# EAGLE design APRS-ESP32_SA8x8_Rev_A (EAGLE 9.6.2)
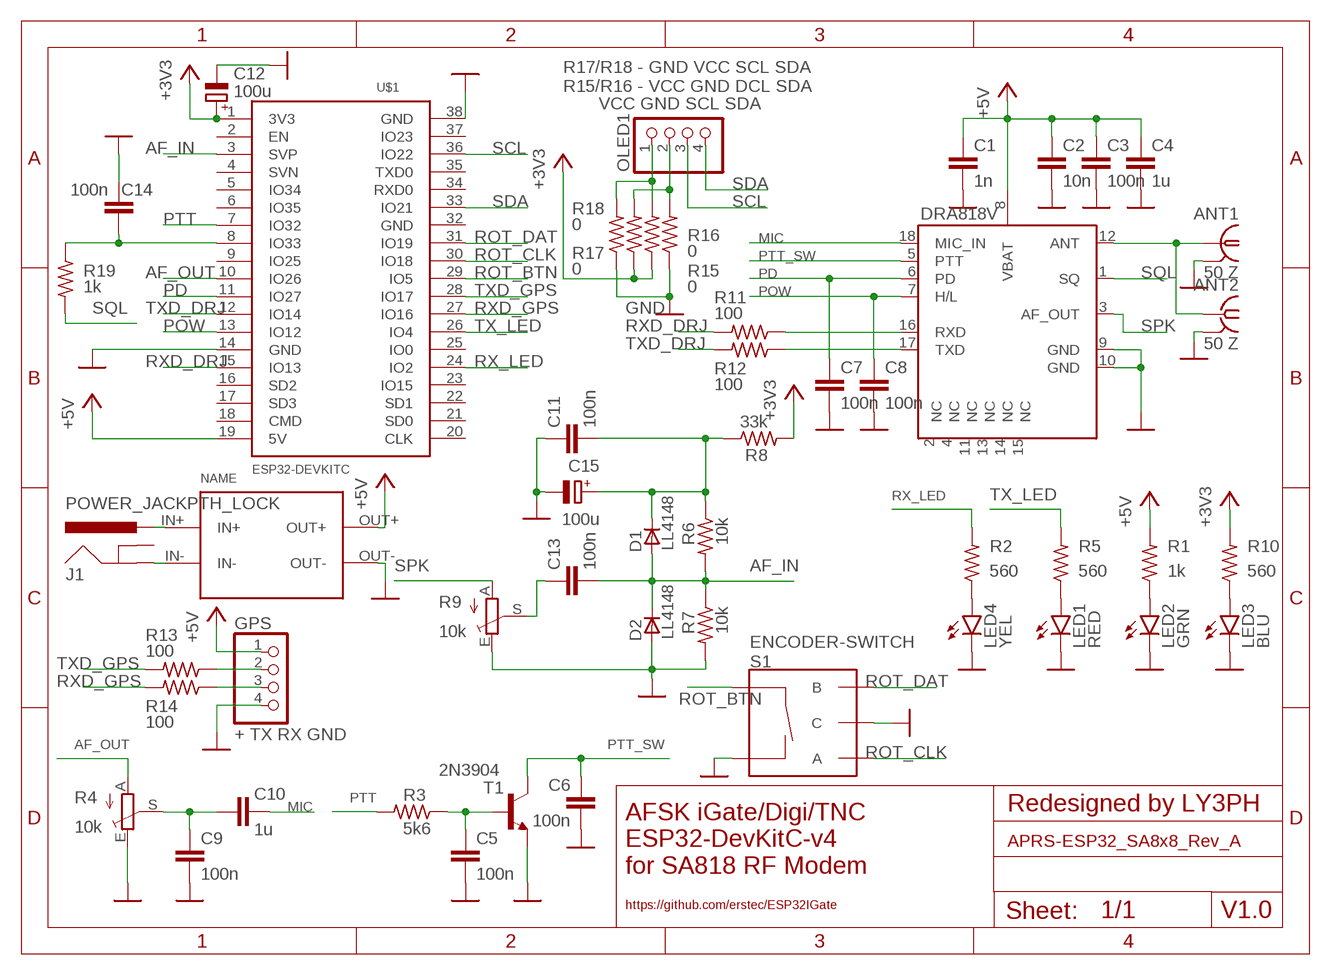
[diagram p0: schematic, sheet 1]

## Parts
ANT1  50 Z  LTI-SASF54GT  [LTI-SASF54GT]
ANT2  50 Z  SMA-142-0701-801/806  [J502-ND-142-0701-801/806]
C1  1n  C-EUC0805  [C0805]
C2  10n  C-EUC0805  [C0805]
C3  100n  C-EUC0805  [C0805]
C4  1u  C-EUC0805  [C0805]
C5  100n  C-EUC0805  [C0805]
C6  100n  C-EUC0805  [C0805]
C7  100n  C-EUC0805  [C0805]
C8  100n  C-EUC0805  [C0805]
C9  100n  C-EUC0805  [C0805]
C10  1u  C-EUC0805  [C0805]
C11  100n  C-EUC0805  [C0805]
C12  100u  CPOL-EUSMCD  [SMC_D]
C13  100n  C-EUC0805  [C0805]
C14  100n  C-EUC0805  [C0805]
C15  100u  CPOL-EUSMCD  [SMC_D]
D1  LL4148  [SOD80_DO213AA_MINIMELF]
D2  LL4148  [SOD80_DO213AA_MINIMELF]
DRA818V  DRA818A  [DRA818A]
GPS  + TX RX GND  PINHD-1X4  [1X04]
J1  POWER_JACKPTH_LOCK  [POWER_JACK_PTH_LOCK]
LED1  RED  LEDCHIP-LED0805  [CHIP-LED0805]
LED2  GRN  LEDCHIP-LED0805  [CHIP-LED0805]
LED3  BLU  LEDCHIP-LED0805  [CHIP-LED0805]
LED4  YEL  LEDCHIP-LED0805  [CHIP-LED0805]
OLED1  VCC GND SCL SDA  PINHD-1X4  [1X04]
R1  1k  R-US_R0805  [R0805]
R2  560  R-US_R0805  [R0805]
R3  5k6  R-US_R0805  [R0805]
R4  10k  TRIM_EU-CA6H  [CA6H]
R5  560  R-US_R0805  [R0805]
R6  10k  R-US_R0805  [R0805]
R7  10k  R-US_R0805  [R0805]
R8  33k  R-US_R0805  [R0805]
R9  10k  TRIM_EU-CA6H  [CA6H]
R10  560  R-US_R0805  [R0805]
R11  100  R-US_R0805  [R0805]
R12  100  R-US_R0805  [R0805]
R13  100  R-US_R0805  [R0805]
R14  100  R-US_R0805  [R0805]
R15  0  R-US_R0805  [R0805]
R16  0  R-US_R0805  [R0805]
R17  0  R-US_R0805  [R0805]
R18  0  R-US_R0805  [R0805]
R19  1k  R-US_R0805  [R0805]
S1  ENCODER-SWITCH  [ROTARY_ENC_PLAIN]
T1  2N3904  MMBT3904LT1-NPN-SOT23-BEC  [SOT23-BEC]
U$1  ESP32DEVKITC  [ESP32-DEVKITC]
U$2  CP8-ADJ  [CP8-ADJ]

## Nets
+3V3: C12.+ R8.2 R10.2 R15.1 R17.1 U$1.1(3V3)
+5V: C1.1 C2.1 C3.1 C4.1 DRA818V.8(VBAT) GPS.1 R1.2 U$1.19(5V) U$2.OUT+
AF_IN: C13.2 D1.A D2.C R6.2 R7.1 U$1.3(SVP)
AF_OUT: R4.A U$1.10(IO26)
GND: ANT1.2 ANT1.3 ANT1.4 ANT1.5 ANT2.G@1 ANT2.G@2 ANT2.G@3 ANT2.G@4 C1.2 C2.2 C3.2 C4.2 C5.2 C6.2 C7.2 C8.2 C9.2 C11.1 C12.- C14.2 C15.- D2.A DRA818V.9(GND) DRA818V.10(GND) GPS.4 LED1.C LED2.C LED3.C LED4.C R4.E R7.2 R9.E R16.1 R18.1 S1.C S1.SW- T1.E U$1.14(GND) U$1.38(GND) U$2.OUT-
MIC: C10.2 DRA818V.18(MIC_IN)
N$1: LED1.A R5.1
N$2: C11.2 C15.+ D1.C R6.1 R8.1
N$3: GPS.2 R13.1
N$4: C13.1 R9.S
N$5: ANT1.1 ANT2.1 DRA818V.12(ANT)
N$6: J1.PWR U$2.IN+
N$7: C5.1 R3.1 T1.B
N$8: LED4.A R2.1
N$9: C9.1 C10.1 R4.S
N$10: J1.GND U$2.IN-
N$12: LED3.A R10.1
N$13: GPS.3 R14.1
N$14: DRA818V.16(RXD) R11.1
N$15: DRA818V.17(TXD) R12.1
N$16: OLED1.2 R16.2 R17.2
N$17: OLED1.1 R15.2 R18.2
N$18: C14.1 R19.1 U$1.8(IO33)
N$41: LED2.A R1.1
PD: C7.1 DRA818V.6(PD) U$1.11(IO27)
POW: C8.1 DRA818V.7(H/L) U$1.13(IO12)
PTT: R3.2 U$1.7(IO32)
PTT_SW: C6.1 DRA818V.5(PTT) T1.C
ROT_BTN: S1.SW+ U$1.29(IO5)
ROT_CLK: S1.A U$1.30(IO18)
ROT_DAT: S1.B U$1.31(IO19)
RX_LED: R2.2 U$1.24(IO2)
RXD_DRJ: R11.2 U$1.15(IO13)
RXD_GPS: R14.2 U$1.27(IO16)
SCL: OLED1.3 U$1.36(IO22)
SDA: OLED1.4 U$1.33(IO21)
SPK: DRA818V.3(AF_OUT) R9.A
SQL: DRA818V.1(SQ) R19.2
TX_LED: R5.2 U$1.26(IO4)
TXD_DRJ: R12.2 U$1.12(IO14)
TXD_GPS: R13.2 U$1.28(IO17)
Unconnected: DRA818V.2(NC) DRA818V.4(NC) DRA818V.11(NC) DRA818V.13(NC) DRA818V.14(NC) DRA818V.15(NC) J1.GNDBREAK U$1.2(EN) U$1.4(SVN) U$1.5(IO34) U$1.6(IO35) U$1.9(IO25) U$1.16(SD2) U$1.17(SD3) U$1.18(CMD) U$1.20(CLK) U$1.21(SD0) U$1.22(SD1) U$1.23(IO15) U$1.25(IO0) U$1.32(GND) U$1.34(RXD0) U$1.35(TXD0) U$1.37(IO23)

## Notes on the sheet
- R17/R18 - GND VCC SCL SDA
  R15/R16 - VCC GND DCL SDA
- Redesigned by LY3PH
- AFSK iGate/Digi/TNC
  ESP32-DevKitC-v4
  for SA818 RF Modem
- https://github.com/erstec/ESP32IGate
- V1.0

## Library data of the parts
ANT1 = con-coax:LTI-SASF54GT: SMA vertical PCB thrue hole jack Source: Lighthorse Technologies, inc. SASF54GT.pdf; OC_FARNELL: unknown; OC_NEWARK: unknown
ANT2 = con-coax:SMA-: SMA 50 Ohm End Launch Jack Receptacle - Round Contact Johnson Components Source: www.johnsoncomponents.com .. J502-ND.pdf; MF: JOHNSON COMPONENTS; MPN: 142-0701-801; OC_FARNELL: 1608592; OC_NEWARK: 90F2624
C1-C11 C13 C14 = resistor:C-EU: CAPACITOR, European symbol
C12 C15 = rcl:CPOL-EU: POLARIZED CAPACITOR, European symbol; SPICEPREFIX: C
D1 D2 = _hhn_diodes_smd:LL4148: 1N4148 General Purpose Rectifie SMD-Version of 1N4148 Case: SOD 80 = DO 213 AA = MINIMELF (Glass) Author: Dipl.-Ing. FH Rainer Bayer HHN Hochschule Heilbronn, rainer.bayer@hs-heilbronn.de Ingenieurbüro ing-rb, mail@ing-rb.de
DRA818V = dorji:DRA818A
GPS OLED1 = pinhead:PINHD-1X4: PIN HEADER
J1 = SparkFun-Connectors:POWER_JACK: Power Jack Connector This is the standard 5.5mm barrel jack for power. The PTH is the most common, proven, reliable, footprint. The Slot footprint only works if the mill layer is transmitted to the PCB fab house so be warned. Here are the connectors we sell at SparkFun: DC Barrel Power Jack/Connector <https://www.sparkfun.com/products/119> (PRT-00119) DC Barrel Power Jack/Connector (SMD) <https://www.sparkfun.com/products/12748> (PRT-12748) DC Barrel Jack Adapter - Breadboard Compatible <https://www.sparkfun.com/products/10811> (PRT-10811) It is used on this SparkFun product (and many, many others): SparkFun RedBoard - Programmed with Arduino <https://www.sparkfun.com/products/12757> (DEV-12757) Also, if you need a mating power supply or connector, please check these out: Wall Adapter Power Supply - 9VDC 650mA <https://www.sparkfun.com/products/298> (TOL-00298) DC Barrel Jack Adapter - Male <https://www.sparkfun.com/products/10287> (PRT-10287); PROD_ID: CONN-08197; SF_ID: PRT-00119
LED1-LED4 = led:LED: LED OSRAM: - CHIPLED LG R971, LG N971, LY N971, LG Q971, LY Q971, LO R971, LY R971 LH N974, LH R974 LS Q976, LO Q976, LY Q976 LO Q996 - Hyper CHIPLED LW Q18S LB Q993, LB Q99A, LB R99A - SideLED LS A670, LO A670, LY A670, LG A670, LP A670 LB A673, LV A673, LT A673, LW A673 LH A674 LY A675 LS A676, LA A676, LO A676, LY A676, LW A676 LS A679, LY A679, LG A679 - Hyper Micro SIDELED® LS Y876, LA Y876, LO Y876, LY Y876 LT Y87S - SmartLED LW L88C, LW L88S LB L89C, LB L89S, LG L890 LS L89K, LO L89K, LY L89K LS L896, LA L896, LO L896, LY L896 - TOPLED LS T670, LO T670, LY T670, LG T670, LP T670 LSG T670, LSP T670, LSY T670, LOP T670, LYG T670 LG T671, LOG T671, LSG T671 LB T673, LV T673, LT T673, LW T673 LH T674 LS T676, LA T676, LO T676, LY T676, LB T676, LH T676, LSB T676, LW T676 LB T67C, LV T67C, LT T67C, LS T67K, LO T67K, LY T67K, LW E67C LS E67B, LA E67B, LO E67B, LY E67B, LB E67C, LV E67C, LT E67C LW T67C LS T679, LY T679, LG T679 LS T770, LO T770, LY T770, LG T770, LP T770 LB T773, LV T773, LT T773, LW T773 LH T774 LS E675, LA E675, LY E675, LS T675 LS T776, LA T776, LO T776, LY T776, LB T776 LHGB T686 LT T68C, LB T68C - Hyper Mini TOPLED® LB M676 - Mini TOPLED Santana® LG M470 LS M47K, LO M47K, LY M47K Source: http://www.osram.convergy.de LUXEON: - LUMILED® LXK2-PW12-R00, LXK2-PW12-S00, LXK2-PW14-U00, LXK2-PW14-V00 LXK2-PM12-R00, LXK2-PM12-S00, LXK2-PM14-U00 LXK2-PE12-Q00, LXK2-PE12-R00, LXK2-PE12-S00, LXK2-PE14-T00, LXK2-PE14-U00 LXK2-PB12-K00, LXK2-PB12-L00, LXK2-PB12-M00, LXK2-PB14-N00, LXK2-PB14-P00, LXK2-PB14-Q00 LXK2-PR12-L00, LXK2-PR12-M00, LXK2-PR14-Q00, LXK2-PR14-R00 LXK2-PD12-Q00, LXK2-PD12-R00, LXK2-PD12-S00 LXK2-PH12-R00, LXK2-PH12-S00 LXK2-PL12-P00, LXK2-PL12-Q00, LXK2-PL12-R00 Source: www.luxeon.com KINGBRIGHT: KA-3528ASYC Source: www.kingbright.com
R1-R3 R5-R8 R10-R19 = resistor:R-US_: RESISTOR, American symbol
R4 R9 = pot:TRIM_EU-: POTENTIOMETER
S1 = SparkFun-Switches:ENCODER-SWITCH: Rotary Encoder w/ Select Switch Encoders rotate similarly to potentiometers, but they’re different from potentiometers in that an encoder has full rotation without limits. They output gray code so that you can tell how much and in which direction the encoder has been turned. This encoder includes a push-down select switch built into the shaft. SparkFun Products Rotary Encoder <https://www.sparkfun.com/products/9117> (COM-09117); SF_SKU: COM-09117
T1 = transistor:*-NPN-: NPN Transistror BF959 corrected 2008.03.06
U$1 = ESP32-DEVKITC:ESP32DEVKITC
U$2 = userlib:CP8-ADJ: Voltage regulator IN: 7-35V OUT: ADJ

## Board
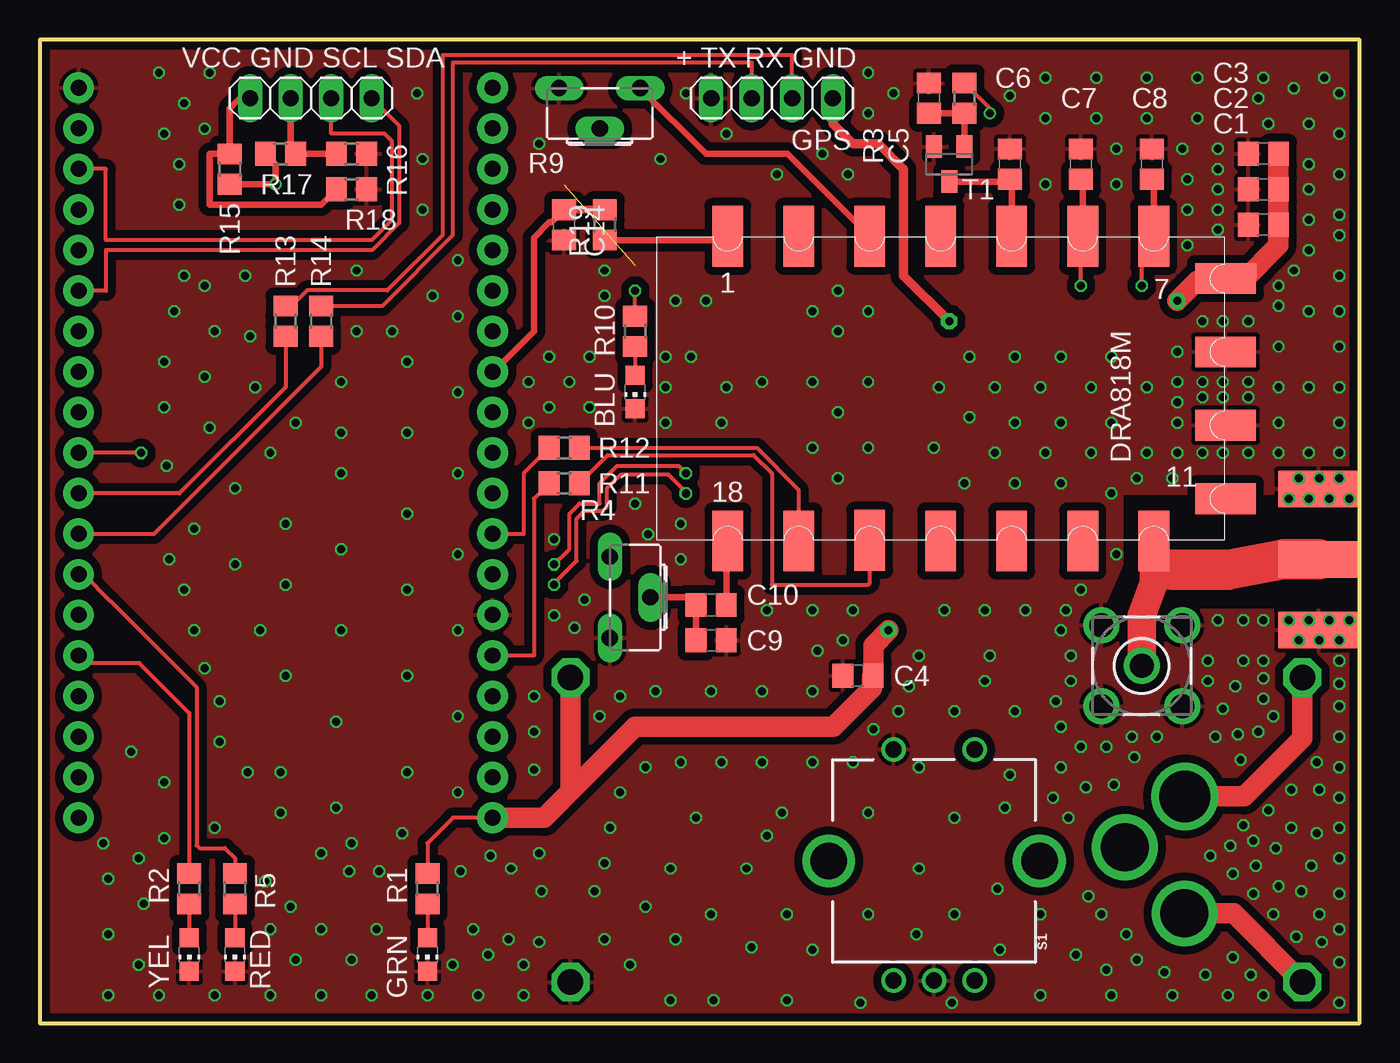
[diagram p1: board, top side]
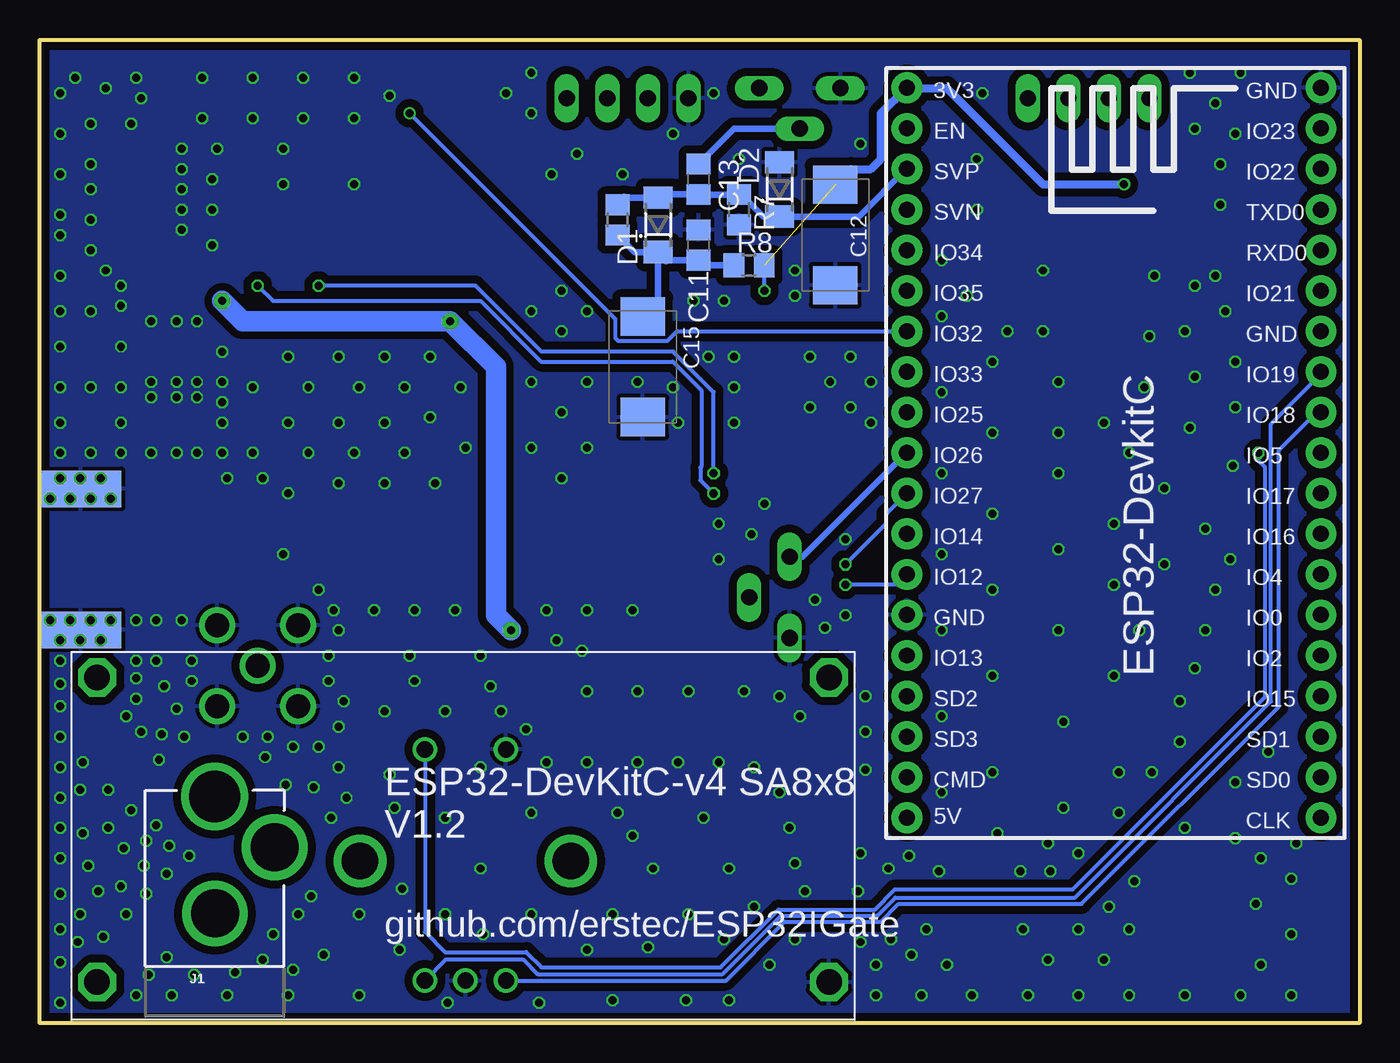
[diagram p2: board, bottom side, seen from below]

Size 82.71 x 61.59 mm. Coordinates in mm from the lower left corner, seen from the top.
Outline: 0,61.6 0,0 82.71,0 82.71,61.6 0,61.6
Copper layers (1*16): Top 0.035559375mm / dielectric 1.6mm / Bottom 0.035559375mm
Design rules "jlcpcb-2layers *": minimum track width 5mil, minimum drill 12mil, track to track 5mil, track to pad 5mil, pad to pad 5mil, via to via 5mil, smd to smd 5mil, copper to edge 8mil, drill to drill 6mil, minimum pad ring 5mil, minimum via ring 3mil, stop-mask expansion 2.5mil, vias tented up to drill 100mil, thermal gap 10mil

### Footprints (pad centres in the part's own frame; a part is rotated, then mirrored left to right if it is on the bottom)
LTI-SASF54GT = drill 1.5 pad 2.2: 1 0,0; 2 -2.54,2.54; 3 2.54,2.54; 4 2.54,-2.54; 5 -2.54,-2.54
J502-ND-142-0701-801/806 = smd 5.08 x 2.286: 1 2.565,0; G@1 2.565,4.42; G@2 2.565,-4.42 | smd 5.08 x 2.286 bottom: G@3 2.565,4.42; G@4 2.565,-4.42
C0805 = smd 1.3 x 1.5: 1 -0.95,0; 2 0.95,0
SMC_D = smd 2.4 x 2.8: + -3.15,0; - 3.15,0
SOD80_DO213AA_MINIMELF = smd 1.4 x 1.8: A 1.7,0; C -1.7,0
DRA818A = smd 3.81 x 1.93: 1 -9.45,-13.25; 2 -9.45,-8.8; 3 -9.45,-4.35; 4 -9.45,0.1; 5 -9.45,4.55; 6 -9.45,9; 7 -9.45,13.45; 12 9.65,13.45; 13 9.65,9; 14 9.65,4.55; 15 9.65,0.1; 16 9.6,-4.35; 17 9.65,-8.8; 18 9.65,-13.25 | smd 1.93 x 3.81: 8 -6.8,17.95; 9 -2.2,17.95; 10 2.4,17.95; 11 7,17.95
1X04 = drill 1.016 long: 1 -3.81,0; 2 -1.27,0; 3 1.27,0; 4 3.81,0
POWER_JACK_PTH_LOCK = drill 2.997 pad 4.115: GND 0.025,6.557; GNDBREAK 3.762,10.7 | drill 3.2 pad 4.115: PWR 0,13.878
CHIP-LED0805 = smd 1.2 x 1.2: A 0,-1.05; C 0,1.05
R0805 = smd 1.3 x 1.5: 1 -0.95,0; 2 0.95,0
CA6H = drill 1.016 long: A -2.54,0; E 2.54,0; S 0,2.54
ROTARY_ENC_PLAIN = drill 1.016: A 7.493,-2.54; B 7.493,2.54; C 7.493,0; SW+ -6.985,2.54; SW- -6.985,-2.54 | drill 2.286: P$3 0,6.604; P$4 0,-6.604
SOT23-BEC = smd 1 x 1.4: B -0.95,-1.1; C 0,1.1; E 0.95,-1.1
ESP32-DEVKITC = drill 1 pad 1.93: 1 -22.87,-14.722; 2 -20.33,-14.722; 3 -17.79,-14.722; 4 -15.25,-14.722; 5 -12.71,-14.722; 6 -10.17,-14.722; 7 -7.63,-14.722; 8 -5.09,-14.722; 9 -2.55,-14.722; 10 -0.01,-14.722; 11 2.53,-14.722; 12 5.07,-14.722; 13 7.61,-14.722; 14 10.15,-14.722; 15 12.69,-14.722; 16 15.23,-14.722; 17 17.77,-14.722; 18 20.31,-14.722; 19 22.85,-14.722; 20 22.85,11.23; 21 20.31,11.23; 22 17.77,11.23; 23 15.23,11.23; 24 12.69,11.23; 25 10.15,11.23; 26 7.61,11.23; 27 5.07,11.23; 28 2.53,11.23; 29 -0.01,11.23; 30 -2.55,11.23; 31 -5.09,11.23; 32 -7.63,11.23; 33 -10.17,11.23; 34 -12.71,11.23; 35 -15.25,11.23; 36 -17.79,11.23; 37 -20.33,11.23; 38 -22.87,11.23
CP8-ADJ = drill 1.6 octagon: IN+ -21.81,7.05; IN- -21.81,-12.036; OUT+ 24.054,7.05; OUT- 24.054,-12.036

### Placement (x,y rotation side)
ANT1  69.06,22.38 0 top
ANT2  82.71,29.05 180 top
C1  76.68,50.01 180 top
C2  76.68,52.23 180 top
C3  76.68,54.45 180 top
C4  51.28,21.75 180 top
C5  55.72,57.94 90 top
C6  60.8,53.82 90 top
C7  65.25,53.82 90 top
C8  69.69,53.82 90 top
C9  42.07,23.97 0 top
C10  42.07,26.19 0 top
C11  41.43,48.74 270 bottom
C12  32.86,49.37 270 bottom
C13  41.43,52.86 270 bottom
C14  32.86,50.01 270 top
C15  44.93,41.12 270 bottom
D1  43.97,50.01 90 bottom
D2  36.35,52.23 90 bottom
DRA818V  56.36,39.85 270 top
GPS  45.88,57.94 180 top
J1  71.76,0.32 0 bottom
LED1  12.22,4.29 180 top
LED2  24.29,4.29 180 top
LED3  37.31,39.53 180 top
LED4  9.37,4.29 180 top
OLED1  16.99,57.94 0 top
R1  24.29,8.41 90 top
R2  9.37,8.41 90 top
R3  57.94,57.94 90 top
R4  35.72,26.67 270 top
R5  12.22,8.41 90 top
R6  46.51,50.32 90 bottom
R7  38.89,50.96 270 bottom
R8  38.26,47.47 0 bottom
R9  35.08,58.58 180 top
R10  37.31,43.34 90 top
R11  32.86,33.81 180 top
R12  32.86,36.04 180 top
R13  15.4,43.97 270 top
R14  17.62,43.97 270 top
R15  11.91,53.5 90 top
R16  19.53,54.45 180 top
R17  15.08,54.45 0 top
R18  19.53,52.23 180 top
R19  35.4,50.01 270 top
S1  56.04,10.16 270 top
T1  56.99,53.82 180 top
U$1  13.65,35.72 270 bottom
U$2  57.31,14.6 0 bottom

### Tracks (layer width: path | path; a pad name or v marks a point on that pad's centre or on a via)
+3V3  (via drill 0.51)  (1 unrouted)
  Top 0.254: R10.2 v37.31,45.88
  Top 0.406: R17.1 14.76,53.82 v14.76,52.55 | R15.1 v14.76,52.55
  Top 0.508: R10.2 | v14.76,52.55
  Bottom 0.254: 28.4,58.58 28.39,58.59 U$1.1 | v37.31,45.88 R8.2
  Bottom 0.508: v14.76,52.55 19.84,52.55 25.88,58.58 28.4,58.58 28.42,58.58 30,56.99 30,54.13 30.64,53.5 31.88,53.5 C12.+
+5V  (via drill 0.5 pad 1.02)
  Top 0.254: U$1.19 25.89,12.87 24.29,11.27 R1.2
  Top 0.61: GPS.1 49.69,56.36 50.96,55.09 52.55,55.09 54.13,53.5 54.13,46.83 v56.99,43.97
  Top 1.27: v53.18,24.61 52.23,23.65 C4.1 52.13,21.65 52.13,20.97 49.74,18.57 37.31,18.57 33.25,14.52 | v71.28,45.24 72.55,46.51 74.17,46.51 DRA818V.8 74.44,46.51 75.41,46.51 77.63,48.73 C1.1 C2.1 C3.1 | U$1.19 28.41,12.87 28.42,12.86 31.59,12.86 33.25,14.52 | U$2.OUT+ 33.25,14.52
  Bottom 1.27: v53.18,24.61 54.13,25.56 54.13,41.12 v56.99,43.97 70.01,43.97 v71.28,45.24
AF_IN
  Bottom 0.406: C13.2 R7.1 38.73,51.91 38.1,51.27 38.11,51.27 37.37,50.53 D2.C 31.39,50.53 28.37,53.54 U$1.3 | C13.2 43.77,51.91 | D1.A 46.08,51.71
  Bottom 0.508: C13.2 | 43.77,51.91 D1.A | 46.08,51.71 R6.2
AF_OUT
  Bottom 0.406: U$1.10 28.37,35.76 34.92,29.21 R4.A
GND  (via drill 0.5 pad 0.61)
  Top 0.508: v80.17,34.13 80.14,34.11 ANT2.G@4 | ANT2.G@4 80.19,33.47 v80.8,32.86 | ANT2.G@4 v79.53,32.86 v78.26,32.86 | ANT2.G@4 79.56,33.47 v78.9,34.13 | ANT2.G@4 80.8,34.13 v81.44,34.13 | ANT2.G@4 81.46,33.47 v82.07,32.86 | ANT2.G@3 79.48,23.97 v78.9,23.97 | ANT2.G@3 80.14,24 v80.17,23.97 | ANT2.G@3 80.8,23.97 v81.44,23.97 | ANT2.G@3 81.46,24.63 v82.07,25.24 | ANT2.G@3 80.19,24.63 v80.8,25.24 | ANT2.G@3 v79.53,25.24 | ANT2.G@3 78.87,24.63 v78.26,25.24
  other vias: 73.82,54.77 73.82,53.5 73.82,52.23 73.82,50.96 73.82,49.69 71.91,48.74 71.91,50.96 71.6,54.77 71.91,52.86 71.28,42.07 72.87,43.97 75.72,43.97 75.72,40.16 72.87,40.16 72.87,39.21 75.72,39.21 75.72,35.72 72.87,35.72 71.28,37.62 71.28,35.72 71.28,40.16 71.28,38.89 74.14,43.97 74.14,39.21 74.14,35.72 74.14,40.16 76.68,25.24 73.82,25.24 67.15,33.18 68.74,34.13 70.96,34.13 77.63,44.93 79.53,44.61 81.44,44.61 35.4,45.56 35.4,47.15 39.85,45.24 41.75,45.24 32.23,30.32 34.13,26.51 76.68,59.21 80.49,59.21 81.44,58.26 81.44,55.72 81.44,53.18 81.44,50.64 81.44,49.37 81.44,46.83 81.44,42.39 81.44,35.72 81.44,37.62 81.44,39.85 77.63,46.2 78.58,47.15 79.53,48.42 79.53,50.32 79.53,52.23 79.53,53.82 79.53,56.36 76.99,56.36 77.63,42.39 77.63,39.85 77.63,37.62 77.63,35.72 79.53,35.72 79.53,39.85 78.58,58.58 76.36,57.94 67.47,52.55 67.47,54.77 46.2,53.18 63.02,52.55 72.55,59.21 69.37,59.21 66.2,59.21 63.02,59.21 60.8,58.1 63.02,56.67 66.2,56.67 69.37,56.67 72.55,56.67 51.91,59.53 53.5,58.26 51.91,56.99 50.64,53.18 49.05,54.45 38.89,54.13 31.27,55.09 31.91,41.75 34.45,41.75 33.18,40.16 31.91,38.58 34.45,38.58 37.31,32.54 38.1,30.64 32.23,25.56 33.5,24.77 40.16,29.05 45.56,25.88 48.42,25.88 50.96,25.88 56.67,25.88 59.21,25.88 61.75,25.88 64.29,25.88 64.61,23.02 64.61,21.43 68.42,17.94 70.01,17.94 73.18,22.7 73.18,21.43 58.26,41.75 61.12,41.75 63.98,41.75 67.15,41.75 59.85,39.85 56.36,39.85 62.71,39.85 65.88,39.85 69.37,39.85 67.15,37.62 69.37,35.72 63.98,37.62 61.12,37.62 58.26,37.94 56.04,36.04 59.85,35.72 63.02,35.72 65.88,35.72 63.98,33.81 61.12,33.81 57.94,33.81 51.91,36.04 48.42,36.04 50.01,34.13 50.01,38.26 48.42,40.16 51.91,40.16 45.24,40.16 42.7,37.62 43.02,39.85 67.47,29.37 75.41,25.24 75.41,22.7 74.93,21.11 75.09,18.1 81.44,19.84 81.44,17.94 81.44,16.03 81.44,14.13 81.44,12.22 81.44,10.32 81.44,8.1 81.44,5.87 73.66,17.94 74.14,19.69 66.83,17.3 65.25,17.3 63.98,18.57 63.66,20.16 63.98,24.61 65.25,27.15 51.91,44.61 50.01,45.88 50.01,43.34 48.42,44.61 39.21,37.62 39.21,39.85 39.21,41.75 40.8,41.75 55.09,23.02 59.53,23.02 57.31,19.53 55.09,16.03 55.09,9.68 54.93,5.56 51.91,6.83 46.83,6.83 42.07,6.83 37.94,7.3 39.53,9.68 45.56,11.75 44.29,9.68 44.61,4.76 48.42,4.6 51.44,1.27 46.83,1.43 42.23,1.43 39.53,1.43 36.99,3.65 35.4,10 34.77,8.25 35.4,5.24 35.72,12.22 36.35,14.45 37.94,16.03 40.16,16.35 42.7,16.35 45.24,16.35 48.42,16.35 50.96,16.35 52.23,18.41 53.82,19.53 54.45,21.11 50.32,23.97 48.74,23.34 48.42,20.8 45.24,20.8 42.07,20.8 38.58,20.8 36.35,20.48 30.96,15.88 30.96,18.26 30.96,20.48 46.51,13.18 51.91,13.18 57.31,12.86 60.48,13.49 60.01,8.41 65.72,7.94 57.31,6.83 62.71,6.83 60.17,4.6 57.15,1.27 62.71,1.75 67.15,1.75 70.96,1.75 68.74,3.97 64.93,4.29 66.52,6.83 39.85,5.24 60.8,15.56 63.98,16.03 61.12,19.53 59.21,21.43 41.12,12.86 40.16,31.27 31.27,10.64 31.43,8.25 31.27,5.08 30.32,3.65 30.32,1.75 27.46,1.75 24.29,1.75 20.8,1.75 17.62,1.75 14.45,1.75 10.95,1.75 7.46,1.75 4.29,1.75 4.29,5.56 4.29,9.05 6.51,7.46 6.19,3.65 16.03,3.97 19.53,3.97 14.45,5.87 17.62,5.87 21.11,5.87 21.27,9.52 17.62,10.64 19.37,9.52 14.13,8.89 25.88,3.65 27.15,5.87 28.26,10.48 29.53,9.68 26.35,9.52 15.72,7.3 7.78,11.59 5.71,16.99 7.78,15.08 7.46,59.53 10.64,59.53 9.05,57.63 7.78,55.72 10.32,56.04 8.73,53.82 8.73,51.28 26.19,47.78 24.61,45.56 22.07,43.34 19.84,43.34 18.89,40.16 16.03,37.62 14.45,35.72 12.22,33.5 9.68,30.96 8.1,29.05 9.05,27.15 9.68,24.61 10.32,22.23 11.27,20.16 11.27,17.62 13.02,15.72 10.95,12.22 26.19,14.45 26.19,24.61 26.19,34.45 26.19,44.29 3.97,11.27 6.19,10.32 26.19,39.53 26.19,29.37 26.19,19.21 10.32,46.2 9.05,46.83 8.41,44.61 7.78,41.43 7.78,38.58 7.94,34.92 10.64,37.31 13.49,39.85 13.18,43.02 12.86,46.83 10.95,43.34 10.32,40.48 19.84,47.15 23.97,50.96 23.97,54.13 23.65,58.26 43.02,55.72 40.48,58.26 30.64,40.16 30.64,37.62 23.02,21.75 23.02,27.15 23.02,31.91 23.02,36.99 23.02,41.43 18.89,36.99 18.89,34.45 18.89,29.69 18.89,24.61 18.57,18.89 23.02,15.72 18.57,13.49 15.08,15.72 15.4,21.75 13.81,24.61 15.4,27.46 12.22,28.73 15.4,31.27 22.7,11.91 19.53,11.27 15.08,13.18 29.37,5.24 28.1,4.29 35.08,19.21 80.17,14.6 80.01,11.91 79.06,8.25 80.17,6.83 79.69,9.84 74.77,4.13 74.45,1.75 76.68,1.75 73.03,3.02 75.88,3.02 70.49,3.18 66.83,3.33 78.42,14.6 80.01,16.35 78.42,12.22 68.58,16.67 67.31,14.92 65.56,14.76 64.45,12.86 63.5,14.13 68.1,5.56 76.68,22.7 76.68,21.59 76.68,20.32 77.31,19.21 76.36,18.26 75.25,16.51 81.44,21.27 81.44,22.7 76.99,13.34 75.41,12.38 74.61,11.11 73.34,10.48 74.77,9.37 76.04,8.1 77.31,6.83 78.74,5.4 76.2,9.84 77.47,10.95 76.04,11.43 77.63,8.57 80.33,5.08 81.44,3.81 81.44,1.27
  pour Bottom (isolate 0.5): 0,0 0,61.59 82.71,61.59 82.71,0
  pour Top (isolate 0.5): 0,0 0,61.59 82.71,61.59 82.71,33.18 67.79,33.18 67.79,28.73 66.52,25.88 82.71,25.88 82.71,0
MIC
  Top 0.406: C10.2 43.02,30.11 DRA818V.18
N$1
  Top 0.254: R5.1 LED1.A
N$2
  Bottom 0.406: R6.1 45.45,48.31 D1.C 43.97,45.22 | 43.45,47.79 C11.2 | 41.11,47.46 R8.1
  Bottom 0.508: D1.C 43.45,47.79 | C11.2 41.11,47.46 | 43.97,45.22 C15.+
N$3
  Top 0.254: GPS.2 47.15,60.64 25.24,60.64 25.24,49.37 21.77,45.9 16.73,45.9 15.75,44.92 R13.1
N$4
  Bottom 0.406: C13.1 39.21,56.04 R9.S
N$5
  Top 1.778: ANT1.1 69.06,25.56 69.81,27.58 DRA818V.12 69.81,28.62 70.01,28.42 70.96,28.42
  Top 2.54: 70.96,28.42 74.45,28.42 77.95,29.05 ANT2.1
N$6
  Top 1.27: U$2.IN+ 79.12,17.84 75.47,14.2 J1.PWR
N$7
  Top 0.406: T1.B R3.1 C5.1
N$8
  Top 0.254: R2.1 LED4.A
N$9
  Top 0.406: C9.1 C10.1 40.64,26.67 R4.S
N$10
  Top 1.27: J1.GND 74.81,6.87 U$2.IN-
N$12
  Top 0.254: R10.1 LED3.A
N$13
  Top 0.254: GPS.3 44.61,60.17 25.88,60.17 25.88,49.36 21.44,44.92 R14.1
N$14
  Top 0.254: R11.1 35.58,35.58 44.74,35.58 45.88,34.44 45.88,27.46 51.91,27.46 52.01,27.56 DRA818V.16
N$15
  Top 0.254: R12.1 44.93,36.04 47.56,33.41 DRA818V.17
N$16
  Top 0.406: R16.2 R17.2 | OLED1.2 15.72,54.77
  Top 0.508: 15.72,54.77 R17.2
N$17
  Top 0.406: R18.2 17.62,51.28 10.64,51.28 10.64,54.45 R15.2 | R15.2 11.91,57.3 12.86,58.26
  Top 0.508: 12.86,58.26 OLED1.1 | R15.2
N$18
  Top 0.406: C14.1 32.07,50.16 31.92,50.16 30.96,49.2 30.96,43.34 28.37,40.76
  Top 0.508: R19.1 C14.1 | 28.37,40.76 U$1.8
N$41
  Top 0.254: R1.1 LED2.A
PD  (via drill 0.51)
  Top 0.254: v32.23,28.73 33.18,29.69 33.18,31.91 33.81,32.54 35.08,32.54 35.08,33.81 36.18,34.91 40.02,34.91 v40.48,34.45 | v65.25,46.2 65.25,49.19 DRA818V.6
  Top 0.406: DRA818V.6 65.36,52.76 C7.1
  Bottom 0.254: v32.23,28.73 29.68,31.28 29.68,31.9 29.64,31.92 U$1.11 | v40.48,34.45 40.48,39.53 43.02,42.07 51.28,42.07 55.4,46.2 v65.25,46.2
POW  (via drill 0.51)
  Top 0.254: v32.23,27.46 32.23,27.55 33.64,28.96 33.64,31.59 34.13,32.09 35.27,32.09 35.54,32.35 35.54,33.5 36.42,34.38 39.37,34.38 40.48,33.26 v40.48,33.18 | v69.06,46.2 69.06,48.55 DRA818V.7
  Top 0.406: DRA818V.7 69.81,52.75 C8.1
  Bottom 0.254: U$1.13 28.37,28.14 29.05,27.46 v32.23,27.46 | v69.06,46.2 68.1,45.24 55.1,45.24 51.29,41.43 43.03,41.43 41.26,39.66 41.26,34.86 41.32,34.8 41.32,34.02 v40.48,33.18
PTT  (via drill 0.5)
  Top 0.254: R3.2 59.53,57.31 v59.53,56.99
  Bottom 0.254: v59.53,56.99 46.66,44.12 46.66,42.93 46.46,42.74 43.39,42.74 42.78,43.35 U$1.7
PTT_SW
  Top 0.406: T1.C 60.65,52.72 C6.1 60.91,52.76 DRA818V.5
ROT_BTN  (via drill 0.51)
  Top 0.254: v6.35,35.72 U$1.29
  Bottom 0.254: S1.SW+ 58.58,5.72 57.31,4.45 52.23,4.45 51.28,3.49 40.04,3.49 36.42,7.11 30.39,7.11 29.13,8.37 17.98,8.37 5.95,20.4 5.95,34.85 6.35,35.24 v6.35,35.72
ROT_CLK
  Bottom 0.254: S1.A 39.72,2.67 36.04,6.35 30,6.35 28.89,7.46 17.44,7.46 5.08,19.82 5.08,35.88 2.69,38.27 U$1.30
ROT_DAT
  Bottom 0.254: S1.B 57.25,3.99 52.44,3.99 51.52,3.07 39.92,3.07 36.26,6.73 30.23,6.73 29.1,7.86 17.86,7.86 5.56,20.16 5.56,37.52 2.42,40.65 U$1.31
RX_LED
  Top 0.254: U$1.24 2.9,22.55 6.23,22.55 9.37,19.42 R2.2
RXD_DRJ
  Top 0.254: R11.2 30.96,32.86 30.96,23.02 28.42,23.02 28.41,23.03 U$1.15
RXD_GPS
  Top 0.254: R14.2 17.62,41.12 7.14,30.64 U$1.27
SCL
  Top 0.254: U$1.36 4.13,53.51 4.13,49.05 20.8,49.05 22.07,50.32 22.07,55.25 21.59,55.72 18.26,55.72 OLED1.3
SDA
  Top 0.254: OLED1.4 22.52,56.22 22.52,50.13 20.81,48.42 4.13,48.42 4.13,45.88 U$1.33
SPK
  Top 0.406: DRA818V.3 46.85,54.45 41.75,54.45 R9.A
SQL
  Top 0.406: R19.2 42.87,49.06
  Top 0.508: 42.87,49.06 DRA818V.1
TX_LED
  Top 0.254: U$1.26 2.74,28.11 4.44,26.4 4.44,26.42 9.82,21.04 9.82,11.13 10,10.95 11.59,10.95 12.22,10.32 R5.2
TXD_DRJ
  Top 0.254: R12.2 30.32,34.45 30.32,30.64 28.42,30.64 28.41,30.65 U$1.12
TXD_GPS
  Top 0.254: R13.2 15.4,39.85 8.73,33.18 U$1.28

### Text on the board
bNames: ESP32-DevKitC-v4 SA8x8 / V1.2 | github.com/erstec/ESP32IGate